# Altium schematic sheet Sheet3.SchDoc
size A4
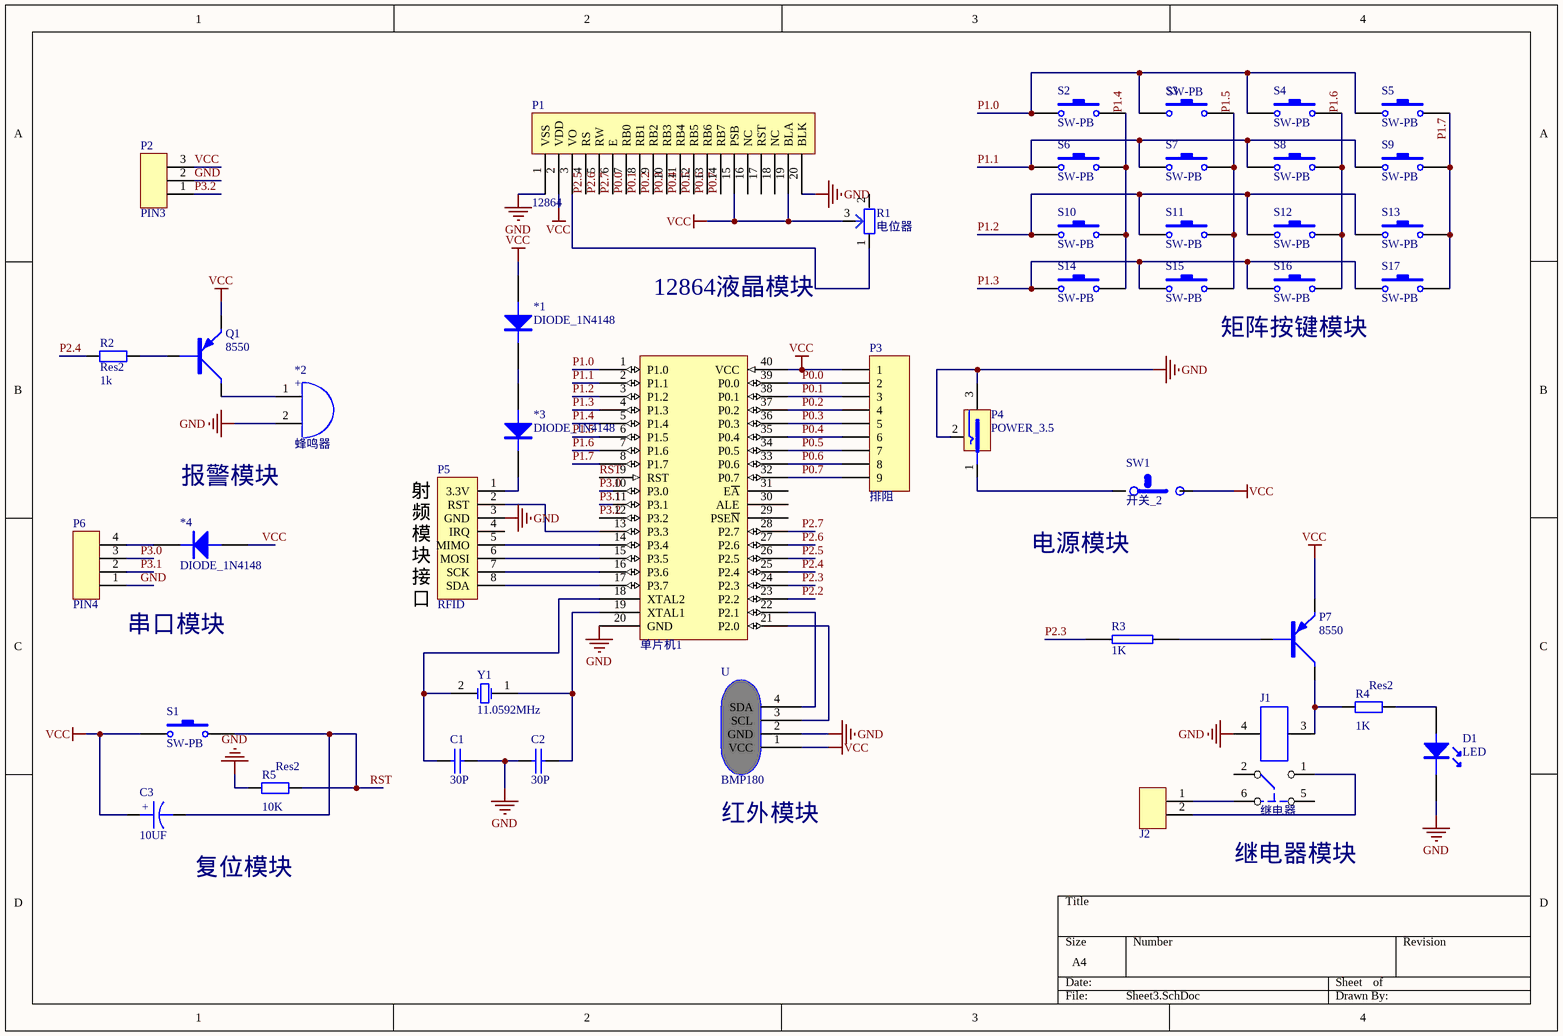
[diagram p0: Sheet3.SchDoc]

## Parts
*1  DIODE_1N4148  [1N4148]
*2  蜂鸣器  [蜂鸣器]
*3  DIODE_1N4148  [1N4148]
*4  DIODE_1N4148  [1N4148]
C1  30P  [CAP_1]
C2  30P  [CAP_1]
C3  10UF  [CAP_2]
D1  LED  [LED]
J1  继电器  [JDQ]
J2  CON2  [SIP2]  (value not drawn)
P1  12864  [12864]
P2  PIN3  [PIN3]
P3  排阻  [HDR1X9]
P4  POWER_3.5  [POWER_3.5]
P5  RFID  [RFID]
P6  PIN4  [PIN4]
P7  8550  [PNP]
Q1  8550  [PNP]
R1  电位器  [电位器]
R2  Res2  value 1k  [AXIAL-0.4]
R3  1K  [RES]
R4  Res2  value 1K  [AXIAL-0.4]
R5  Res2  value 10K  [AXIAL-0.4]
S1  SW-PB  [6X6X?]
S2  SW-PB  [6X6X?]
S3  SW-PB  [6X6X?]
S4  SW-PB  [6X6X?]
S5  SW-PB  [6X6X?]
S6  SW-PB  [6X6X?]
S7  SW-PB  [6X6X?]
S8  SW-PB  [6X6X?]
S9  SW-PB  [6X6X?]
S10  SW-PB  [6X6X?]
S11  SW-PB  [6X6X?]
S12  SW-PB  [6X6X?]
S13  SW-PB  [6X6X?]
S14  SW-PB  [6X6X?]
S15  SW-PB  [6X6X?]
S16  SW-PB  [6X6X?]
S17  SW-PB  [6X6X?]
SW1  开关_2  [开关_2]
U  BMP180  [BMP180]
Y1  11.0592MHz  [晶振]
单片机1  AT89S52  [DIP40C]  (value not drawn)

## Nets
GND: *2.2 C1.2 C2.1 D1.2 J1.4 P1.1(VSS) P1.20(BLK) P2.2 P4.2 P4.3 P5.3(GND) P6.1 R5.1 U.2(GND) 单片机1.20(GND)
VCC: *1.A *4.A C3.1 P1.2(VDD) P1.15(PSB) P1.19(BLA) P2.3 P3.1 P7.1(E) Q1.1(E) R1.3 S1.1 SW1.2 U.1(VCC) 单片机1.40(VCC)
P0.0: P1.7(RB0) P3.2 单片机1.39(P0.0)
P0.1: P1.8(RB1) P3.3 单片机1.38(P0.1)
P0.2: P1.9(RB2) P3.4 单片机1.37(P0.2)
P0.3: P1.10(RB3) P3.5 单片机1.36(P0.3)
P0.4: P1.11(RB4) P3.6 单片机1.35(P0.4)
P0.5: P1.12(RB5) P3.7 单片机1.34(P0.5)
P0.6: P1.13(RB6) P3.8 单片机1.33(P0.6)
P0.7: P1.14(RB7) P3.9 单片机1.32(P0.7)
P1.0: S2.1 S3.1 S4.1 S5.1 单片机1.1(P1.0)
P1.1: S6.1 S7.1 S8.1 S9.1 单片机1.2(P1.1)
P1.2: S10.1 S11.1 S12.1 S13.1 单片机1.3(P1.2)
P1.3: S14.1 S15.1 S16.1 S17.1 单片机1.4(P1.3)
P1.4: S2.2 S6.2 S10.2 S14.2 单片机1.5(P1.4)
P1.5: S3.2 S7.2 S11.2 S15.2 单片机1.6(P1.5)
P1.6: S4.2 S8.2 S12.2 S16.2 单片机1.7(P1.6)
P1.7: S5.2 S9.2 S13.2 S17.2 单片机1.8(P1.7)
P2.2: 单片机1.23(P2.2)
P2.3: R3.1 单片机1.24(P2.3)
P2.4: R2.2 单片机1.25(P2.4)
P2.5: P1.4(RS) 单片机1.26(P2.5)
P2.6: P1.5(RW) 单片机1.27(P2.6)
P2.7: P1.6(E) 单片机1.28(P2.7)
P3.0: P6.3 单片机1.10(P3.0)
P3.1: P6.2 单片机1.11(P3.1)
P3.2: P2.1 单片机1.12(P3.2)
RST: C3.2 R5.2 S1.2 单片机1.9(RST)
Net*1_K: *1.K *3.A
Net*2_1: *2.1 Q1.3(C)
Net*3_K: *3.K P5.1(3.3V)
Net*4_K: *4.K P6.4
NetC1_1: C1.1 Y1.2(OSC2) 单片机1.18(XTAL2)
NetC2_2: C2.2 Y1.1(OSC1) 单片机1.19(XTAL1)
NetD1_1: D1.1 R4.2
NetJ1_1: J1.1 J2.2
NetJ1_3: J1.3 P7.3(C) R4.1
NetJ1_6: J1.6 J2.1
NetP1_3: P1.3(VO) R1.1
NetP4_1: P4.1 SW1.1
NetP5_2: P5.2(RST) 单片机1.13(P3.3)
NetP5_5: P5.5(MIMO) 单片机1.14(P3.4)
NetP5_6: P5.6(MOSI) 单片机1.15(P3.5)
NetP5_7: P5.7(SCK) 单片机1.16(P3.6)
NetP5_8: P5.8(SDA) 单片机1.17(P3.7)
NetP7_2: P7.2(B) R3.2
NetQ1_2: Q1.2(B) R2.1
NetU_3: U.3(SCL) 单片机1.21(P2.0)
NetU_4: U.4(SDA) 单片机1.22(P2.1)

Not connected (* = marked no-connect by the designer): J1 2 5; P1 16(NC) 17(RST) 18(NC); P5 4(IRQ); R1 2; 单片机1 29(PSE~{N}) 30(ALE) 31(E~{A})

## Notes on the sheet
- 12864液晶模块
- 矩阵按键模块
- 报警模块
- 电源模块
- (near P6) 串口模块
- (near P5) 射频模块接口
- 红外模块
- 复位模块
- (near J1) 继电器模块
- (in symbol CAP_2) +
- (in symbol 蜂鸣器) +

## Library data of the parts
C1 C2 = CAP_1
C3 = CAP_2
J2 = CON2: SOCKET
P3 = Header 9: Header, 9-Pin; LatestRevisionDate: 17-Jul-2002; LatestRevisionNote: Re-released for DXP Platform.; Publisher: Altium Limited
P7 Q1 = PNP
R2 R4 R5 = Res2: Resistor; Published: 8-Jun-2000; LatestRevisionDate: 17-Jul-2002; LatestRevisionNote: Re-released for DXP Platform.; PackageReference: AXIAL-0.4; Publisher: Altium Limited; PackageDescription: Axial Device, Thru-Hole; 2 Leads; 0.4 in Pin Spacing
R3 = RES
S1-S17 = SW-PB: Switch; Published: 24-Mar-1999; LatestRevisionDate: 17-Jul-2002; LatestRevisionNote: Re-released for DXP Platform.; PackageReference: SPST-2; Publisher: Altium Limited
Y1 = XTAL: Crystal Oscillator; Published: 8-Jun-2000; LatestRevisionDate: 17-Jul-2002; LatestRevisionNote: Re-released for DXP Platform.; PackageReference: R38; Publisher: Altium Limited